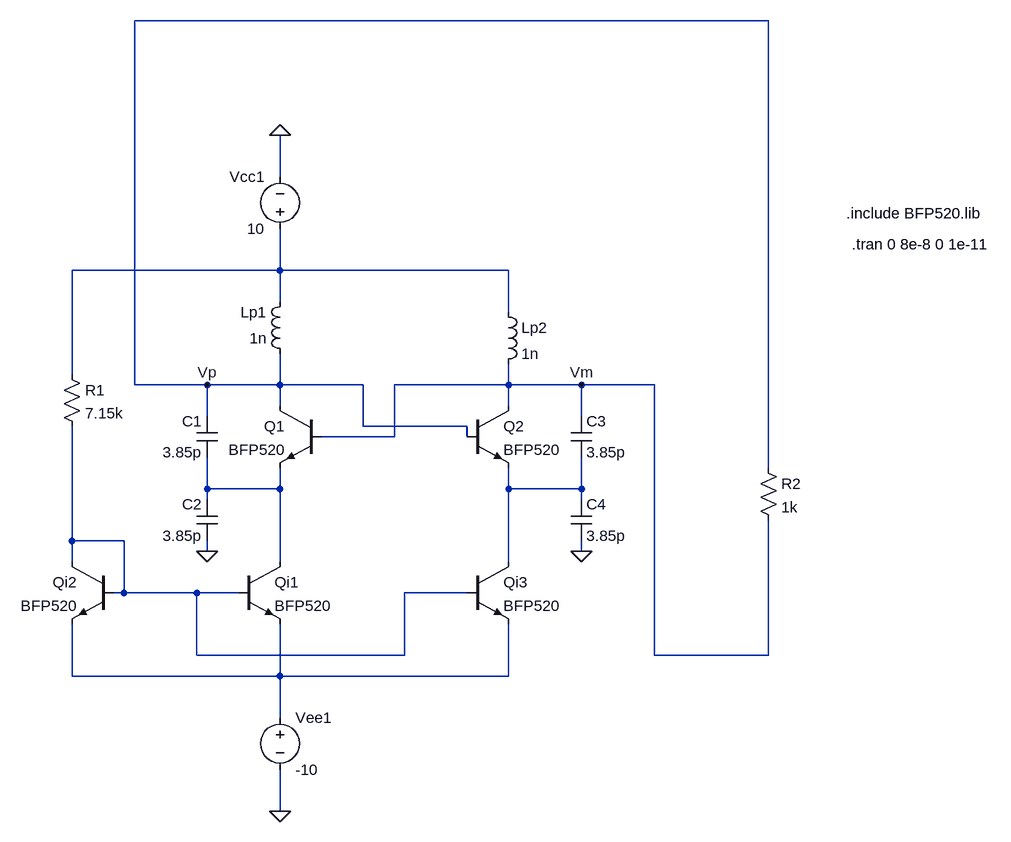
[diagram p0: schematic diff.asc]
diff.asc, the LTspice schematic file:
Version 4
SHEET 1 1444 864
WIRE 1088 -368 112 -368
WIRE 336 -128 336 -192
WIRE 336 16 336 -48
WIRE 336 16 16 16
WIRE 688 16 336 16
WIRE 336 64 336 16
WIRE 688 80 688 16
WIRE 16 176 16 16
WIRE 112 192 112 -368
WIRE 224 192 112 192
WIRE 336 192 336 144
WIRE 336 192 224 192
WIRE 464 192 336 192
WIRE 688 192 688 160
WIRE 688 192 512 192
WIRE 800 192 688 192
WIRE 912 192 800 192
WIRE 336 224 336 192
WIRE 688 224 688 192
WIRE 224 240 224 192
WIRE 800 240 800 192
WIRE 464 256 464 192
WIRE 624 256 464 256
WIRE 512 272 512 192
WIRE 512 272 400 272
WIRE 624 272 624 256
WIRE 1088 320 1088 -368
WIRE 224 352 224 304
WIRE 336 352 336 320
WIRE 336 352 224 352
WIRE 688 352 688 320
WIRE 800 352 800 304
WIRE 800 352 688 352
WIRE 224 368 224 352
WIRE 800 368 800 352
WIRE 16 432 16 256
WIRE 96 432 16 432
WIRE 224 448 224 432
WIRE 800 448 800 432
WIRE 16 464 16 432
WIRE 336 464 336 352
WIRE 688 464 688 352
WIRE 96 512 96 432
WIRE 96 512 80 512
WIRE 208 512 96 512
WIRE 272 512 208 512
WIRE 624 512 528 512
WIRE 208 608 208 512
WIRE 528 608 528 512
WIRE 528 608 208 608
WIRE 912 608 912 192
WIRE 1088 608 1088 400
WIRE 1088 608 912 608
WIRE 16 640 16 560
WIRE 336 640 336 560
WIRE 336 640 16 640
WIRE 688 640 688 560
WIRE 688 640 336 640
WIRE 336 704 336 640
WIRE 336 848 336 784
FLAG 336 -192 0
FLAG 336 848 0
FLAG 224 448 0
FLAG 224 192 Vp
FLAG 800 448 0
FLAG 800 192 Vm
SYMBOL npn 400 224 M0
SYMATTR InstName Q1
SYMATTR Value BFP520
SYMBOL ind 352 160 R180
WINDOW 0 36 80 Left 2
WINDOW 3 36 40 Left 2
SYMATTR InstName Lp1
SYMATTR Value 1n
SYMBOL Voltage 336 -32 R180
WINDOW 0 24 96 Left 2
WINDOW 3 24 16 Left 2
SYMATTR InstName Vcc1
SYMATTR Value 10
SYMBOL npn 272 464 R0
SYMATTR InstName Qi1
SYMATTR Value BFP520
SYMBOL npn 80 464 M0
SYMATTR InstName Qi2
SYMATTR Value BFP520
SYMBOL Res 0 160 R0
SYMATTR InstName R1
SYMATTR Value 7.15k
SYMBOL Voltage 336 688 R0
SYMATTR InstName Vee1
SYMATTR Value -10
SYMBOL cap 240 240 M0
SYMATTR InstName C1
SYMATTR Value 3.85p
SYMBOL cap 240 368 M0
SYMATTR InstName C2
SYMATTR Value 3.85p
SYMBOL npn 624 224 R0
SYMATTR InstName Q2
SYMATTR Value BFP520
SYMBOL cap 784 240 R0
SYMATTR InstName C3
SYMATTR Value 3.85p
SYMBOL cap 784 368 R0
SYMATTR InstName C4
SYMATTR Value 3.85p
SYMBOL ind 672 64 R0
SYMATTR InstName Lp2
SYMATTR Value 1n
SYMBOL npn 624 464 R0
SYMATTR InstName Qi3
SYMATTR Value BFP520
SYMBOL res 1072 304 R0
SYMATTR InstName R2
SYMATTR Value 1k
TEXT 1208 -72 Left 2 !.include BFP520.lib
TEXT 1216 -24 Left 2 !.tran 0 8e-8 0 1e-11

The netlist it stands for:
* diff.asc
Q1 Vp Vm N002 0 BFP520
Lp1 Vp N001 1n
Vcc1 N001 0 10
Qi1 N002 N004 N005 0 BFP520
Qi2 N004 N004 N005 0 BFP520
R1 N001 N004 7.15k
Vee1 N005 0 -10
C1 Vp N002 3.85p
C2 N002 0 3.85p
Q2 Vm Vp N003 0 BFP520
C3 Vm N003 3.85p
C4 N003 0 3.85p
Lp2 N001 Vm 1n
Qi3 N003 N004 N005 0 BFP520
R2 Vp Vm 1k
.model NPN NPN
.model PNP PNP
.lib standard.bjt
.include BFP520.lib
.tran 0 8e-8 0 1e-11
.backanno
.end